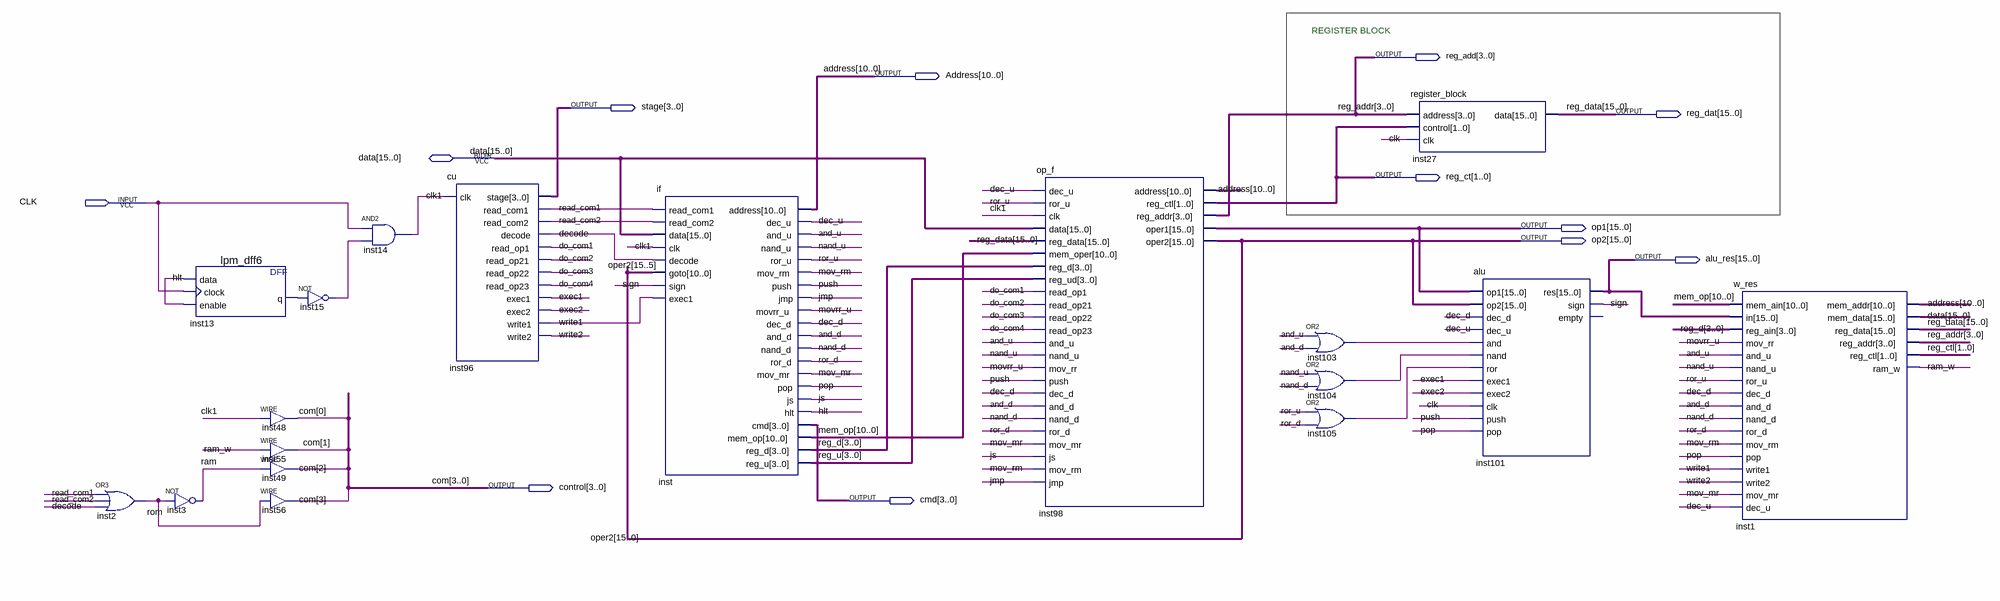
[diagram p0: schematic sheet]
// Quartus schematic cpu.bdf as structural Verilog: 18 symbols, 12 pins
module cpu (
  input  CLK,
  inout  [15:0] data,
  output [3:0] reg_add,
  output [10:0] Address,
  output [3:0] stage,
  output [15:0] reg_dat,
  output [1:0] reg_ct,
  output [15:0] op1,
  output [15:0] op2,
  output [15:0] alu_res,
  output [3:0] control,
  output [3:0] cmd
);

  wire and_d, and_u, clk1, dec_d, dec_u, decode, do_com1, do_com2, do_com3, do_com4, exec1, exec2, hlt,
       inst13_q, inst15_out, inst103_out, inst104_out, inst105_out, jmp, js, mov_mr, mov_rm, movrr_u, nand_d,
       nand_u, pop, push, ram, ram_w, read_com1, read_com2, rom, ror_d, ror_u, sign, write1, write2;
  wire [1:0] reg_ctl;
  wire [3:0] reg_d, reg_u;
  wire [10:0] mem_op;

  or inst2 (rom, read_com1, read_com2, decode);
  lpm_dff6 inst13 (.data(hlt), .clock(CLK), .enable(hlt), .q(inst13_q));
  not inst3 (ram, rom);
  assign control[0] = clk1;  // WIRE inst48
  assign control[1] = ram_w;  // WIRE inst55
  assign control[2] = ram;  // WIRE inst49
  assign control[3] = rom;  // WIRE inst56
  not inst15 (inst15_out, inst13_q);
  and inst14 (clk1, CLK, inst15_out);
  cu inst96 (
    .clk(clk1), .stage(stage), .read_com1(read_com1), .read_com2(read_com2), .decode(decode),
    .read_op1(do_com1), .read_op21(do_com2), .read_op22(do_com3), .read_op23(do_com4), .exec1(exec1),
    .exec2(exec2), .write1(write1), .write2(write2));
  \if  inst (
    .read_com1(read_com1), .read_com2(read_com2), .data(data), .clk(clk1), .decode(decode), .goto(op2[15:5]),
    .sign(sign), .exec1(write1), .address(Address), .dec_u(dec_u), .and_u(and_u), .nand_u(nand_u),
    .ror_u(ror_u), .mov_rm(mov_rm), .push(push), .jmp(jmp), .movrr_u(movrr_u), .dec_d(dec_d), .and_d(and_d),
    .nand_d(nand_d), .ror_d(ror_d), .mov_mr(mov_mr), .pop(pop), .js(js), .hlt(hlt), .cmd(cmd),
    .mem_op(mem_op), .reg_d(reg_d), .reg_u(reg_u));
  op_f inst98 (
    .dec_u(dec_u), .ror_u(ror_u), .clk(clk1), .data(data), .reg_data(reg_dat), .mem_oper(mem_op),
    .reg_d(reg_d), .reg_ud(reg_u), .read_op1(do_com1), .read_op21(do_com2), .read_op22(do_com3),
    .read_op23(do_com4), .and_u(and_u), .nand_u(nand_u), .mov_rr(movrr_u), .push(push), .dec_d(dec_d),
    .and_d(and_d), .nand_d(nand_d), .ror_d(ror_d), .mov_mr(mov_mr), .js(js), .mov_rm(mov_rm), .jmp(jmp),
    .address(Address), .reg_ctl(reg_ct), .reg_addr(reg_add), .oper1(op1), .oper2(op2));
  or inst103 (inst103_out, and_u, and_d);
  or inst104 (inst104_out, nand_u, nand_d);
  or inst105 (inst105_out, ror_u, ror_d);
  register_block inst27 (.address(reg_add), .control(reg_ct), .clk(CLK), .data(reg_dat));
  alu inst101 (
    .op1(op1), .op2(op2), .dec_d(dec_d), .dec_u(dec_u), .\and (inst103_out), .\nand (inst104_out),
    .ror(inst105_out), .exec1(exec1), .exec2(exec2), .clk(CLK), .push(push), .pop(pop), .res(alu_res),
    .sign(sign));  // open: empty
  w_res inst1 (
    .mem_ain(mem_op), .in(alu_res), .reg_ain(reg_d), .mov_rr(movrr_u), .and_u(and_u), .nand_u(nand_u),
    .ror_u(ror_u), .dec_d(dec_d), .and_d(and_d), .nand_d(nand_d), .ror_d(ror_d), .mov_rm(mov_rm), .pop(pop),
    .write1(write1), .write2(write2), .mov_mr(mov_mr), .dec_u(dec_u), .mem_addr(Address), .mem_data(data),
    .reg_data(reg_dat), .reg_addr(reg_add), .reg_ctl(reg_ctl), .ram_w(ram_w));

  // Other names for the same wires on the sheet: com[3:0] = control; oper2[15:0] = op2; reg_addr[3:0] = reg_add;
  //   reg_data[15:0] = reg_dat

  // Notes on the sheet:
  //   REGISTER BLOCK
endmodule
